# Altium project PS3604LF.PrjPcb
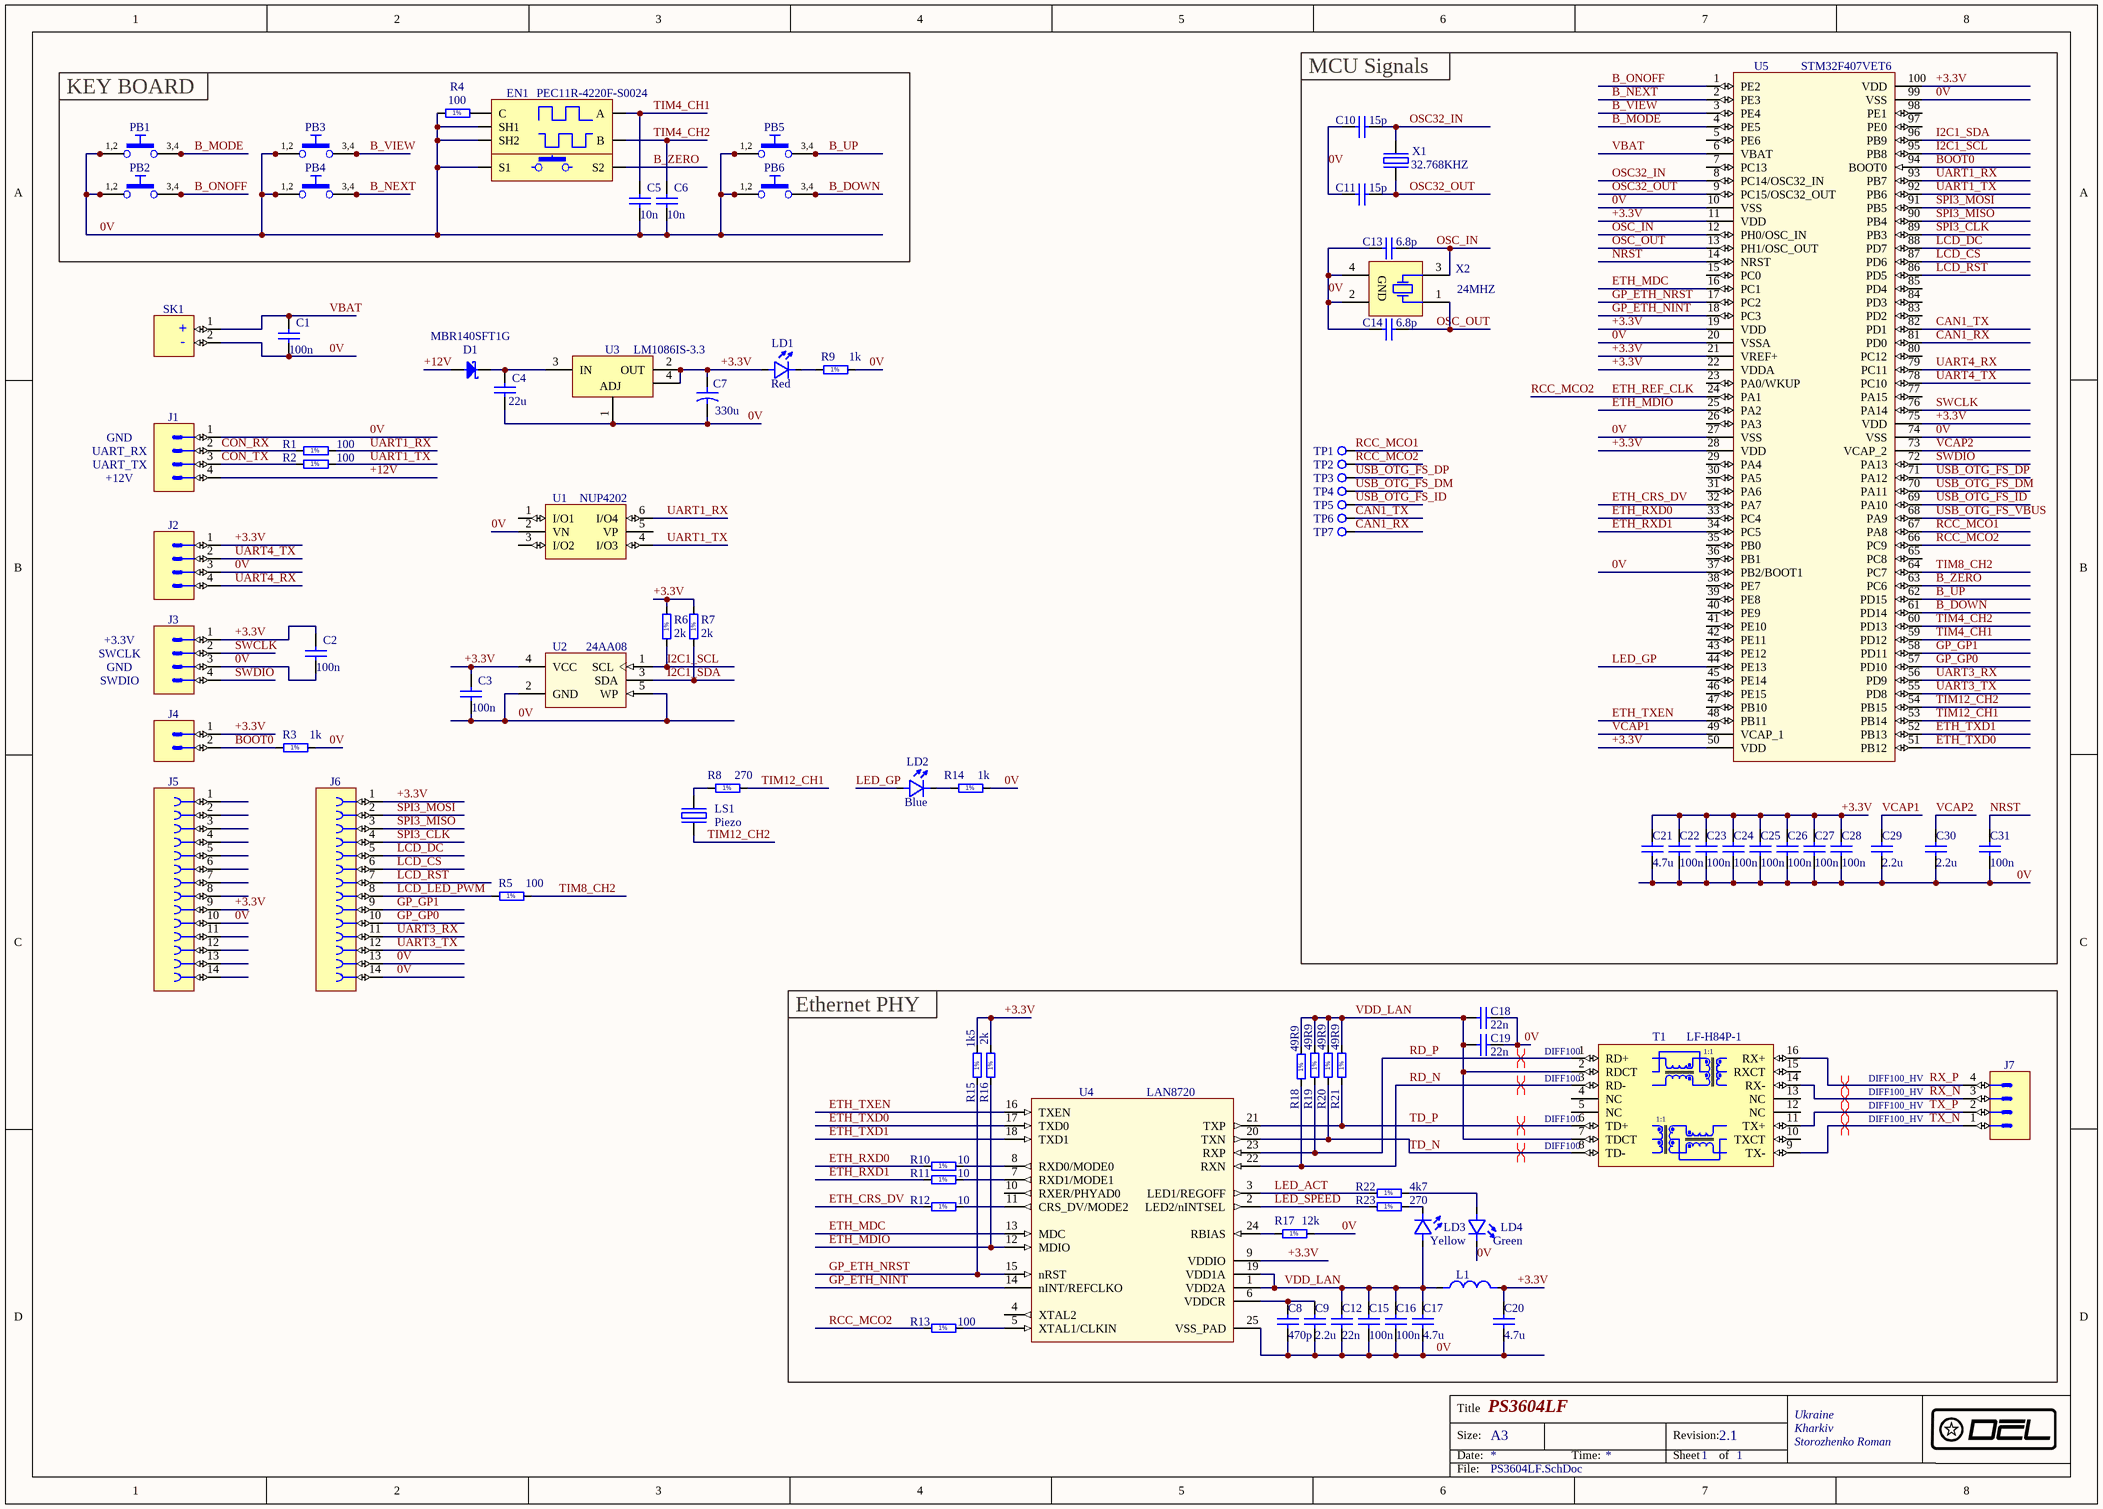
[diagram p0: PS3604LF.SchDoc]
1 sheet, 91 parts. Net scope: global (net labels, ports and power ports of the same name join across sheets).
Board file: PS3604LF.PcbDoc

## Sheet PS3604LF.SchDoc: PS3604LF
size A3; Author: Storozhenko Roman; CompanyName: D_EL; DrawnBy: Storozhenko Roman; Address1: Ukraine; Address2: Kharkiv; Revision: 2.1; SheetNumber: 1; SheetTotal: 1

### Parts
C1  100n  [CAPC1005X55N]
C2  100n  [CAPC1005X55N]
C3  100n  [CAPC1005X55N]
C4  22u  [CAPC3216X100N]
C5  10n  [CAPC1005X55N]
C6  10n  [CAPC1005X55N]
C7  330u  [CAPMP7343X310N]
C8  470p  [CAPC1005X55N]
C9  2.2u  [CAPC1005X55N]
C10  15p  [CAPC1005X55N]
C11  15p  [CAPC1005X55N]
C12  22n  [CAPC1005X55N]
C13  6.8p  [CAPC1005X55N]
C14  6.8p  [CAPC1005X55N]
C15  100n  [CAPC1005X55N]
C16  100n  [CAPC1005X55N]
C17  4.7u  [CAPC1608X87N]
C18  22n  [CAPC1005X55N]
C19  22n  [CAPC1005X55N]
C20  4.7u  [CAPC1608X87N]
C21  4.7u  [CAPC1608X87N]
C22  100n  [CAPC1005X55N]
C23  100n  [CAPC1005X55N]
C24  100n  [CAPC1005X55N]
C25  100n  [CAPC1005X55N]
C26  100n  [CAPC1005X55N]
C27  100n  [CAPC1005X55N]
C28  100n  [CAPC1005X55N]
C29  2.2u  [CAPC1005X55N]
C30  2.2u  [CAPC1005X55N]
C31  100n  [CAPC1005X55N]
D1  MBR140SFT1G  [SOD-123FL]
EN1  PEC11R-4220F-S0024  [EN_BOURNS_PEC11R-4x20F-Sxxxx]
J1  SPOX  [MOLEX_22-03-5045]  (value not drawn)
J2  Header 4  [3M_2304-6111-TG]  (value not drawn)
J3  Header 4  [3M_2304-6111-TG]  (value not drawn)
J4  Header 2  [3M_2302-6111-TG]  (value not drawn)
J5  Socket 14  [3M_955114-6102-AR]  (value not drawn)
J6  Socket 14  [3M_955114-6102-AR]  (value not drawn)
J7  SPOX  [MOLEX_22-03-5045]  (value not drawn)
L1  2.2uH  [INDC2520X100N]  (value not drawn)
LD1  Red  [LEDC1608X80N_RED]
LD2  Blue  [LEDC1608X80N_BLUE]
LD3  Yellow  [LEDC1608X80N_YELLOW]
LD4  Green  [LEDC1608X80N_GREEN]
LS1  Piezo  [HPS13C]
PB1  Push Button  [PB_E-SWITCH_TL1105HF100Q]  (value not drawn)
PB2  Push Button  [PB_E-SWITCH_TL1105HF100Q]  (value not drawn)
PB3  Push Button  [PB_E-SWITCH_TL1105HF100Q]  (value not drawn)
PB4  Push Button  [PB_E-SWITCH_TL1105HF100Q]  (value not drawn)
PB5  Push Button  [PB_E-SWITCH_TL1105HF100Q]  (value not drawn)
PB6  Push Button  [PB_E-SWITCH_TL1105HF100Q]  (value not drawn)
R1  100  [RESC1005X40N]
R2  100  [RESC1005X40N]
R3  1k  [RESC1005X40N]
R4  100  [RESC1005X40N]
R5  100  [RESC1005X40N]
R6  2k  [RESC1005X40N]
R7  2k  [RESC1005X40N]
R8  270  [RESC1005X40N]
R9  1k  [RESC1005X40N]
R10  10  [RESC1005X40N]
R11  10  [RESC1005X40N]
R12  10  [RESC1005X40N]
R13  100  [RESC1005X40N]
R14  1k  [RESC1005X40N]
R15  1k5  [RESC1005X40N]
R16  2k  [RESC1005X40N]
R17  12k  [RESC1005X40N]
R18  49R9  [RESC1005X40N]
R19  49R9  [RESC1005X40N]
R20  49R9  [RESC1005X40N]
R21  49R9  [RESC1005X40N]
R22  4k7  [RESC1005X40N]
R23  270  [RESC1005X40N]
SK1  BH500  [EEMB_BH500]  (value not drawn)
T1  LF-H84P-1  [XFMR_LF-H84P]
TP1  Test Point  [TP_SMD_800]  (value not drawn)
TP2  Test Point  [TP_SMD_800]  (value not drawn)
TP3  Test Point  [TP_SMD_800]  (value not drawn)
TP4  Test Point  [TP_SMD_800]  (value not drawn)
TP5  Test Point  [TP_SMD_800]  (value not drawn)
TP6  Test Point  [TP_SMD_800]  (value not drawn)
TP7  Test Point  [TP_SMD_800]  (value not drawn)
U1  NUP4202  [SOT65P220X110-6N]
U2  24AA08  [SOT95P280X145-5N]
U3  LM1086IS-3.3  [TO254P1435X464-4N-R1041X635]
U4  LAN8720  [QFN50P400X400X100-25N-S265]
U5  STM32F407VET6  [QFP50P1600X1600X160-100N]
X1  32.768KHZ  [OSCCC150X320X80-2N]
X2  24MHZ  [OSCCC160X200X65-4N]

### Blocks framed on the sheet
MCU Signals: C10 C11 C13 C14 C21-C31 TP1-TP7 U5 X1 X2
KEY BOARD: C5 C6 EN1 PB1-PB6 R4
Ethernet PHY: C8 C9 C12 C15-C20 J7 L1 LD3 LD4 R10-R13 R15-R23 T1 U4

### Nets
0V: C1.1 C2.1 C3.1 C4.1 C5.1 C6.1 C7.2 C8.1 C9.1 C10.1 C11.1 C12.2 C13.1 C14.1 C15.1 C16.1 C17.1 C18.2 C19.2 C20.1 C21.1 C22.1 C23.1 C24.1 C25.1 C26.1 C27.1 C28.1 C29.1 C30.1 C31.1 EN1.S1 EN1.SH1 EN1.SH2 J1.1 J2.3 J3.3 J5.10 J6.13 J6.14 LD4.1(C) PB1.1 PB1.2 PB2.1 PB2.2 PB3.1 PB3.2 PB4.1 PB4.2 PB5.1 PB5.2 PB6.1 PB6.2 R3.2 R4.1 R9.2 R14.2 R17.2 SK1.2 U1.2(VN) U2.2(GND) U2.5(WP) U3.1(ADJ) U4.25(VSS_PAD) U5.10(VSS) U5.20(VSSA) U5.27(VSS) U5.37(PB2/BOOT1) U5.74(VSS) U5.99(VSS) X2.2(GND) X2.4(GND)
+3.3V: C2.2 C3.2 C7.1 C20.2 C21.2 C22.2 C23.2 C24.2 C25.2 C26.2 C27.2 C28.2 J2.1 J3.1 J4.1 J5.9 J6.1 L1.2 LD1.2(A) R6.2 R7.2 R15.2 R16.2 U2.4(VCC) U3.2(OUT) U3.4(OUT) U4.9(VDDIO) U5.11(VDD) U5.19(VDD) U5.21(VREF+) U5.22(VDDA) U5.28(VDD) U5.50(VDD) U5.75(VDD) U5.100(VDD)
+12V: D1.2(A) J1.4
B_DOWN: PB6.3 PB6.4 U5.61(PD14)
B_MODE: PB1.3 PB1.4 U5.4(PE5)
B_NEXT: PB4.3 PB4.4 U5.2(PE3)
B_ONOFF: PB2.3 PB2.4 U5.1(PE2)
B_UP: PB5.3 PB5.4 U5.62(PD15)
B_VIEW: PB3.3 PB3.4 U5.3(PE4)
B_ZERO: EN1.S2 U5.63(PC6)
BOOT0: J4.2 R3.1 U5.94(BOOT0)
CAN1_RX: TP7.1 U5.81(PD0)
CAN1_TX: TP6.1 U5.82(PD1)
CON_RX: J1.2 R1.1
CON_TX: J1.3 R2.1
ETH_CRS_DV: R12.1 U5.32(PA7)
ETH_MDC: U4.13(MDC) U5.16(PC1)
ETH_MDIO: R16.1 U4.12(MDIO) U5.25(PA2)
ETH_REF_CLK: R13.1 TP2.1 U5.24(PA1) U5.66(PC9)  [also labelled RCC_MCO2]
ETH_RXD0: R10.1 U5.33(PC4)
ETH_RXD1: R11.1 U5.34(PC5)
ETH_TXD0: U4.17(TXD0) U5.51(PB12)
ETH_TXD1: U4.18(TXD1) U5.52(PB13)
ETH_TXEN: U4.16(TXEN) U5.48(PB11)
GP_ETH_NINT: U4.14(nINT/REFCLKO) U5.18(PC3)
GP_ETH_NRST: R15.1 U4.15(nRST) U5.17(PC2)
GP_GP0: J6.10 U5.57(PD10)
GP_GP1: J6.9 U5.58(PD11)
I2C1_SCL: R6.1 U2.1(SCL) U5.95(PB8)
I2C1_SDA: R7.1 U2.3(SDA) U5.96(PB9)
LCD_CS: J6.6 U5.87(PD6)
LCD_DC: J6.5 U5.88(PD7)
LCD_LED_PWM: J6.8 R5.1
LCD_RST: J6.7 U5.86(PD5)
LED_ACT: R22.1 U4.3(LED1/REGOFF)
LED_GP: LD2.2(A) U5.44(PE13)
LED_SPEED: R23.1 U4.2(LED2/nINTSEL)
NRST: C31.2 U5.14(NRST)
OSC32_IN: C10.2 U5.8(PC14/OSC32_IN) X1.2(OSC2)
OSC32_OUT: C11.2 U5.9(PC15/OSC32_OUT) X1.1(OSC1)
OSC_IN: C13.2 U5.12(PH0/OSC_IN) X2.3(X)
OSC_OUT: C14.2 U5.13(PH1/OSC_OUT) X2.1(X)
RCC_MCO1: TP1.1 U5.67(PA8)
RD_N: R18.1 T1.3(RD-) U4.22(RXN)
RD_P: R19.1 T1.1(RD+) U4.23(RXP)
RX_N: J7.3 T1.14(RX-)
RX_P: J7.4 T1.16(RX+)
SPI3_CLK: J6.4 U5.89(PB3)
SPI3_MISO: J6.3 U5.90(PB4)
SPI3_MOSI: J6.2 U5.91(PB5)
SWCLK: J3.2 U5.76(PA14)
SWDIO: J3.4 U5.72(PA13)
TD_N: R20.1 T1.8(TD-) U4.20(TXN)
TD_P: R21.1 T1.6(TD+) U4.21(TXP)
TIM4_CH1: C5.2 EN1.A U5.59(PD12)
TIM4_CH2: C6.2 EN1.B U5.60(PD13)
TIM8_CH2: R5.2 U5.64(PC7)
TIM12_CH1: R8.2 U5.53(PB14)
TIM12_CH2: LS1.1(OSC1) U5.54(PB15)
TX_N: J7.1 T1.9(TX-)
TX_P: J7.2 T1.11(TX+)
UART1_RX: R1.2 U1.6(I/O4) U5.93(PB7)
UART1_TX: R2.2 U1.4(I/O3) U5.92(PB6)
UART3_RX: J6.11 U5.56(PD9)
UART3_TX: J6.12 U5.55(PD8)
UART4_RX: J2.4 U5.79(PC11)
UART4_TX: J2.2 U5.78(PC10)
USB_OTG_FS_DM: TP4.1 U5.70(PA11)
USB_OTG_FS_DP: TP3.1 U5.71(PA12)
USB_OTG_FS_ID: TP5.1 U5.69(PA10)
USB_OTG_FS_VBUS: U5.68(PA9)
VBAT: C1.2 SK1.1 U5.6(VBAT)
VCAP1: C29.2 U5.49(VCAP_1)
VCAP2: C30.2 U5.73(VCAP_2)
VDD_LAN: C12.1 C15.2 C16.2 C17.2 C18.1 C19.1 L1.1 LD3.2(A) R18.2 R19.2 R20.2 R21.2 T1.2(RDCT) T1.7(TDCT) U4.1(VDD2A) U4.19(VDD1A)
NetC4_2: C4.2 D1.1(C) U3.3(IN)
NetC8_2: C8.2 C9.2 U4.6(VDDCR)
NetEN1_C: EN1.C R4.2
NetLD1_1: LD1.1(C) R9.1
NetLD2_1: LD2.1(C) R14.1
NetLD3_1: LD3.1(C) R23.2
NetLD4_2: LD4.2(A) R22.2
NetLS1_2: LS1.2(OSC2) R8.1
NetR10_2: R10.2 U4.8(RXD0/MODE0)
NetR11_2: R11.2 U4.7(RXD1/MODE1)
NetR12_2: R12.2 U4.11(CRS_DV/MODE2)
NetR13_2: R13.2 U4.5(XTAL1/CLKIN)
NetR17_1: R17.1 U4.24(RBIAS)

Not connected (* = marked no-connect by the designer): J5 1 2 3 4 5 6 7 8 11 12 13 14; T1 4(NC) 5(NC) 10(TXCT) 12(NC) 13(NC) 15(RXCT); U1 1(I/O1) 3(I/O2) 5(VP); U4 4(XTAL2) 10(RXER/PHYAD0); U5 5(PE6) 7(PC13) 15(PC0) 23(PA0/WKUP) 26(PA3) 29(PA4) 30(PA5) 31(PA6) 35(PB0) 36(PB1) 38(PE7) 39(PE8) 40(PE9) 41(PE10) 42(PE11) 43(PE12) 45(PE14) 46(PE15) 47(PB10) 65(PC8) 77(PA15) 80(PC12) 83(PD2) 84(PD3) 85(PD4) 97(PE0) 98(PE1)

### Layout directives
differential pair; net class DIFF100: RD_N, RD_P, TD_N, TD_P
differential pair; net class DIFF100_HV: RX_N, RX_P, TX_N, TX_P

### Notes on the sheet
- GND
- (near J1) UART_RX
- +12V
- (near J1) UART_TX
- +3.3V
- SWCLK
- SWDIO
- Title
- Size:
- Date:
- A3
- Time:
- Revision:
- Sheet
- of
- File:
- (in symbol EEMB_BH500) +; -
- (in symbol PB_E-SWITCH_TL1105HF100Q) 1,2; 3,4
- (in symbol R0402_1K5_1%_0.0625W_100PPM) 1%
- (in symbol R0402_1K_1%_0.0625W_100PPM) 1%
- (in symbol R0402_2K_1%_0.0625W_100PPM) 1%
- (in symbol R0402_4K7_1%_0.0625W_100PPM) 1%
- (in symbol R0402_10R_1%_0.0625W_200PPM) 1%
- (in symbol R0402_12K_1%_0.0625W_100PPM) 1%
- (in symbol R0402_49R9_1%_0.0625W_100PPM) 1%
- (in symbol R0402_100R_1%_0.0625W_100PPM) 1%
- (in symbol R0402_270R_1%_0.0625W_100PPM) 1%
- (in symbol XFMR_LF-H84P-1) 1:1

### Library data of the parts
C1-C3 C15 C16 C22-C28 C31 = CC0402_100NF_50V_10%_X7R: Non-polarised capacitor; Part Description: SMD Multilayer Chip Ceramic Capacitor; Manufacturer: GENERIC; Manufacturer1 Part Number: C0402B104K500NU; Voltage: 50V; TC: X7R; Tolerance: ±10%; Part Number: CC0402_100NF_50V_10%_X7R; Component Kind: Standard; Component Type: Standard; Pin Count: 2; Value: 100n; Status: Not Recommended; Manufacturer Part Number: CC0402_100NF_50V_10%_X7R; Case: 0402; Mounted: Yes; Socket: No; SMD: Yes; Manufacturer1 Example: HITANO; Manufacturer1 ComponentHeight: 0.55mm; Author: DEL; CreateDate: 13.11.2017; LatestRevisionDate: 13.11.2017
C4 = CC1206_22UF_16V_20%_X5R: Non-polarised capacitor; Part Description: SMD Multilayer Chip Ceramic Capacitor; Manufacturer: GENERIC; Manufacturer1 Part Number: CL31A226MOCLNNC; Voltage: 16V; TC: X5R; Tolerance: ±20%; Part Number: CC1206_22UF_16V_20%_X5R; Component Kind: Standard; Component Type: Standard; Pin Count: 2; Value: 22u; Status: Preferred; Manufacturer Part Number: CC1206_22UF_16V_20%_X5R; Case: 1206; Mounted: Yes; Socket: No; SMD: Yes; Manufacturer1 Example: Samsung; Manufacturer1 ComponentHeight: 1mm; Author: D_EL; CreateDate: 13.06.2017; LatestRevisionDate: 13.06.2017
C5 C6 = CC0402_10NF_50V_10%_X7R: Non-polarised capacitor; Part Description: SMD Multilayer Chip Ceramic Capacitor; Manufacturer: GENERIC; Manufacturer1 Part Number: C0402C103K5RACTU; Voltage: 50V; TC: X7R; Tolerance: ±10%; Part Number: CC0402_10NF_50V_10%_X7R; Component Kind: Standard; Component Type: Standard; Pin Count: 2; Value: 10n; Status: None; Manufacturer Part Number: CC0402_10NF_50V_10%_X7R; Case: 0402; Mounted: Yes; Socket: No; SMD: Yes; Manufacturer1 Example: KEMET; Manufacturer1 ComponentHeight: 0.55mm; Author: DEL; CreateDate: 19.12.2017; LatestRevisionDate: 19.12.2017
C7 = CTE7343-31_330UF_6.3V_20%_LESR0025_KEMET_T520: Polarised capacitor; Part Description: Low ESR 0R025 Tantalum Chip Capacitor; Manufacturer: KEMET; Manufacturer Part Number: T520D337M006ATE025; Voltage: 6.3V; Tolerance: ±20%; Part Number: CTE7343-31_330UF_6.3V_20%_LESR0025_KEMET_T520; Component Kind: Standard; Component Type: Standard; Pin Count: 2; Value: 330u; Status: None; Case: D; Mounted: Yes; Socket: No; SMD: Yes; ComponentHeight: 3.1mm; HelpURL: \\cern.ch\dfs\Applications\Altium\Datasheets\CTE-LESR_KEMET_T520.pdf; Author: CERN DEM JLC; CreateDate: 20.10.2010; LatestRevisionDate: 20.10.2010
C8 = CC0402_470PF_50V_10%_X7R: Non-polarised capacitor; Part Description: SMD Multilayer Chip Ceramic Capacitor; Manufacturer: GENERIC; Manufacturer1 Part Number: 223858715618; Voltage: 50V; TC: X7R; Tolerance: ±10%; Part Number: CC0402_470PF_50V_10%_X7R; Component Kind: Standard; Component Type: Standard; Pin Count: 2; Value: 470p; Status: Not Recommended; Manufacturer Part Number: CC0402_470PF_50V_10%_X7R; Case: 0402; Mounted: Yes; Socket: No; SMD: Yes; Manufacturer1 Example: PHYCOMP; Manufacturer1 ComponentHeight: 0.55mm; HelpURL: \\cern.ch\dfs\Applications\Altium\Datasheets\CC0402_NP0_PHYCOMP.pdf; Author: CERN DEM JLC; CreateDate: 03.12.2007; LatestRevisionDate: 03.12.2007
C9 C29 C30 = CC0402_2.2UF_6.3V_20%_X5R: Non-polarised capacitor; Part Description: SMD Multilayer Chip Ceramic Capacitor; Manufacturer: GENERIC; Voltage: 6.3V; TC: X5R; Tolerance: ±20%; Part Number: CC0402_2.2UF_6.3V_20%_X5R; Component Kind: Standard; Component Type: Standard; Pin Count: 2; Value: 2.2u; Status: Preferred; Manufacturer Part Number: CC0402_2.2UF_6.3V_20%_X5R; Case: 0402; Mounted: Yes; Socket: No; SMD: Yes; Manufacturer1 ComponentHeight: 0.55mm; HelpURL: \\cern.ch\dfs\Applications\Altium\Datasheets\CC0402_X5R_KEMET.pdf; Author: ELMAN; CreateDate: 19.05.2015; LatestRevisionDate: 19.05.2015
C10 C11 = CC0402_15PF_50V_5%_NP0: Non-polarised capacitor; Part Description: SMD Multilayer Chip Ceramic Capacitor; Manufacturer: GENERIC; Manufacturer1 Part Number: 223886915159; Voltage: 50V; TC: NP0; Tolerance: ±5%; Part Number: CC0402_15PF_50V_5%_NP0; Component Kind: Standard; Component Type: Standard; Pin Count: 2; Value: 15p; Status: Not Recommended; Manufacturer Part Number: CC0402_15PF_50V_5%_NP0; Case: 0402; Mounted: Yes; Socket: No; SMD: Yes; Manufacturer1 Example: PHYCOMP; Manufacturer1 ComponentHeight: 0.55mm; HelpURL: \\cern.ch\dfs\Applications\Altium\Datasheets\CC0402_NP0_PHYCOMP.pdf; Author: CERN DEM JLC; CreateDate: 03.12.2007; LatestRevisionDate: 03.12.2007
C12 C18 C19 = CC0402_22NF_16V_10%_X7R: Non-polarised capacitor; Part Description: SMD Multilayer Chip Ceramic Capacitor; Manufacturer: GENERIC; Manufacturer1 Part Number: 223878715641; Voltage: 16V; TC: X7R; Tolerance: ±10%; Part Number: CC0402_22NF_16V_10%_X7R; Component Kind: Standard; Component Type: Standard; Pin Count: 2; Value: 22n; Status: Not Recommended; Manufacturer Part Number: CC0402_22NF_16V_10%_X7R; Case: 0402; Mounted: Yes; Socket: No; SMD: Yes; Manufacturer1 Example: PHYCOMP; Manufacturer1 ComponentHeight: 0.55mm; HelpURL: \\cern.ch\dfs\Applications\Altium\Datasheets\CC0402_X7R_PHYCOMP.pdf; Author: CERN DEM JLC; CreateDate: 03.12.2007; LatestRevisionDate: 03.12.2007
C13 C14 = CC0402_6.8PF_50V_0.5PF_NP0: Non-polarised capacitor; Part Description: SMD Multilayer Chip Ceramic Capacitor; Manufacturer: GENERIC; Manufacturer1 Part Number: 223886915688; Voltage: 50V; TC: NP0; Tolerance: ±0.5pF; Part Number: CC0402_6.8PF_50V_0.5PF_NP0; Component Kind: Standard; Component Type: Standard; Pin Count: 2; Value: 6.8p; Status: Not Recommended; Manufacturer Part Number: CC0402_6.8PF_50V_0.5PF_NP0; Case: 0402; Mounted: Yes; Socket: No; SMD: Yes; Manufacturer1 Example: PHYCOMP; Manufacturer1 ComponentHeight: 0.55mm; HelpURL: \\cern.ch\dfs\Applications\Altium\Datasheets\CC0402_NP0_PHYCOMP.pdf; Author: CERN DEM JLC; CreateDate: 03.12.2007; LatestRevisionDate: 03.12.2007
C17 C20 C21 = CC0603_4.7UF_10V_10%_X5R: Non-polarised capacitor; Part Description: SMD Multilayer Chip Ceramic Capacitor; Manufacturer: GENERIC; Manufacturer1 Part Number: C1608X5R1A475K080AC; Voltage: 10V; TC: X5R; Tolerance: ±10%; Part Number: CC0603_4.7UF_10V_10%_X5R; Component Kind: Standard; Component Type: Standard; Pin Count: 2; Value: 4.7u; Status: Preferred; Manufacturer Part Number: CC0603_4.7uF_10V_10%_X5R; Case: 0603; Mounted: Yes; Socket: No; SMD: Yes; Manufacturer1 Example: TDK; Manufacturer1 ComponentHeight: 0.95mm; Author: ELMAN; CreateDate: 13.11.2016; LatestRevisionDate: 13.11.2016
D1 = MBR140SFT1G: Schottky Diode; Part Description: Schottky Power Rectifier; Manufacturer: ON SEMICONDUCTOR; Voltage: 40V; Power: 1A; Part Number: MBR140SFT1G; Component Kind: Standard; Component Type: Standard; Device: MBR140SFT1G; PackageDescription: Small Outline Diode Flat Lead (SOD-123FL), Body; 2.70mm L X 1.65mm W X 1.0mm H; Manufacturer Part Number: MBR140SFT1G; Pin Count: 2; Case: SOD-123FL; Mounted: Yes; Socket: No; SMD: Yes; ComponentHeight: 1.0mm; HelpURL: \\cern.ch\dfs\Applications\Altium\Datasheets\MBR140SFT1G.pdf; Author: CERN DEM JLC; CreateDate: 06.04.2009; LatestRevisionDate: 06.04.2009
EN1 = EN_BOUNCE_PEC11R-4220F-S0024: Encoder incremental with push momentary switch; Part Description: 12 mm Incremental Encoder,  24 pulses, Push Momentary Switch; Manufacturer: BOURNS; Part Number: EN_BOUNCE_PEC11R-4220F-S0024; Component Kind: Standard; Component Type: Standard; Pin Count: 5; PackageDescription: Standard Shaft Length 20.0 mm; Family: Incremental Encoder; Mounted: Yes; Socket: No; SMD: No; Status: None; Manufacturer Part Number: PEC11R-4220F-S0024; ComponentHeight: 26.5mm; Author: DEL; CreateDate: 09.11.2017; LatestRevisionDate: 09.11.2017
J1 J7 = MOLEX_22-03-5045: Connector 4 Male; Part Description: 2.50mm Pitch SPOX Wire-to-Board Header, Vertical, Shrouded, 4 Circuits, Tin (Sn) Plating; Manufacturer: MOLEX; Part Number: MOLEX_22-03-5045; Component Kind: Standard; Component Type: Standard; Pin Count: 4; Family: SPOX; Mounted: Yes; Socket: No; SMD: No; Status: None; Manufacturer Part Number: 22-27-2041; ComponentHeight: 5.9mm; Author: DEL; CreateDate: 21.10.2017; LatestRevisionDate: 21.10.2017
J2 J3 = 3M_2304-6111-TG: Connector 4 Male; Part Description: 4 Contacts - Vertival Contacts Straight Strip Header Pitch 2.54; Manufacturer: 3M; Part Number: 3M_2304-6111-TG; Component Kind: Standard; Component Type: Standard; Pin Count: 4; Family: Header 4; Mounted: Yes; Socket: No; SMD: No; Status: None; Manufacturer Part Number: 3M_2304-6111-TG; ComponentHeight: 8.4mm; Author: DEL; CreateDate: 2018-09-13; LatestRevisionDate: 2018-09-13
J4 = 3M_2302-6111-TG: Connector 2 Male; Part Description: 2 Contacts - Horizontal Contacts Straight Strip Header Pitch 2.54; Manufacturer: 3M; Part Number: 3M_2302-6111-TG; Component Kind: Standard; Component Type: Standard; Pin Count: 2; Family: Header 2; Mounted: Yes; Socket: No; SMD: No; Status: None; Manufacturer Part Number: 3M_2302-6111-TG; ComponentHeight: 8.4mm; Author: DEL; CreateDate: 2018-09-13; LatestRevisionDate: 2018-09-13
J5 J6 = 3M_955114-6102-AR: Connector 14 Female; Part Description: 14 Contacts - 2mm x 2 mm Straight, Boardmount Socket, 950 Serie; Manufacturer: 3M; Part Number: 3M_955114-6102-AR; Component Kind: Standard; Component Type: Standard; Pin Count: 14; Family: Socket 14; Mounted: Yes; Socket: No; SMD: No; Status: None; Manufacturer Part Number: 955114-6102-AR; ComponentHeight: 4.3mm; Author: DEL; CreateDate: 02.11.2017; LatestRevisionDate: 02.11.2017
L1 = IND1008_2.2UH_20%_TDK_MLP2520S2R2MT0S1: Inductor; Part Description: SMT Inductors; Manufacturer: TDK; Power: 1.2A; Resistance: 0.117R; Tolerance: ±20%; Part Number: IND1008_2.2UH_20%_TDK_MLP2520S2R2MT0S1; Component Kind: Standard; Component Type: Standard; Pin Count: 2; Value: 2.2uH; Status: None; Manufacturer Part Number: MLP2520S2R2MT0S1; Case: 1008; Mounted: Yes; Socket: No; SMD: Yes; ComponentHeight: 1mm; HelpURL: C:\eftek\library\doc\DS_SPICE\capacitors\TDK\inductor_commercial_power_mlp2520_en.pdf; Author: ELMAN; CreateDate: 02.02.2016; LatestRevisionDate: 02.02.2016
LD1 = LED_OF-SMD1608R: LED 1C 2A; Part Description: Surface Mount Red LED (0603 Case); Manufacturer: OPTOFLASH; Part Number: LED_OF-SMD1608R; Component Kind: Standard; Component Type: Standard; Color: Red; PackageDescription: Chip Red LED, 2-Leads, Body 1.6x0.8mm, IPC Medium Density; Manufacturer Part Number: OF-SMD1608R; Pin Count: 2; Case: 0603; Mounted: Yes; Socket: No; SMD: Yes; ComponentHeight: 0.8mm; Author: ELMAN; CreateDate: 27.08.2015; LatestRevisionDate: 27.08.2015
LD2 = LED_OF-SMD1608B: LED 1C 2A; Part Description: Surface Mount Red LED (0603 Case); Manufacturer: OPTOFLASH; Part Number: LED_OF-SMD1608B; Component Kind: Standard; Component Type: Standard; Color: Blue; PackageDescription: Chip Blue LED, 2-Leads, Body 1.6x0.8mm, IPC Medium Density; Manufacturer Part Number: OF-SMD1608B; Pin Count: 2; Case: 0603; Mounted: Yes; Socket: No; SMD: Yes; ComponentHeight: 0.8mm; Author: DEL; CreateDate: 11.12.2017; LatestRevisionDate: 11.12.2017
LD3 = LED_OF-SMD1608Y: LED 1C 2A; Part Description: Surface Mount Red LED (0603 Case); Manufacturer: OPTOFLASH; Manufacturer Part Number: OF-SMD1608R; Part Number: LED_OF-SMD1608Y; Component Kind: Standard; Component Type: Standard; Color: Yellow; PackageDescription: Chip Yellow LED, 2-Leads, Body 1.6x0.8mm, IPC Medium Density; Pin Count: 2; Case: 0603; Mounted: Yes; Socket: No; SMD: Yes; ComponentHeight: 0.8mm; Author: DEL; CreateDate: 11.12.2017; LatestRevisionDate: 11.12.2017
LD4 = LED_OF-SMD1608G: LED 1C 2A; Part Description: Surface Mount Green LED (0603 Case); Manufacturer: OPTOFLASH; Part Number: LED_OF-SMD1608G; Component Kind: Standard; Component Type: Standard; Color: Green; PackageDescription: Chip Green LED, 2-Leads, Body 1.6x0.8mm, IPC Medium Density; Manufacturer Part Number: OF-SMD1608G; Pin Count: 2; Case: 0603; Mounted: Yes; Socket: No; SMD: Yes; ComponentHeight: 0.8mm; Author: ELMAN; CreateDate: 27.08.2015; LatestRevisionDate: 27.08.2015
LS1 = HPS13C: Piezo Sounder; Part Description: Piezo sound generator; Manufacturer: JL WORLD; Output: >= 80 dB; Part Number: HPS13C; Component Kind: Standard; Component Type: Standard; Pin Count: 2; PackageDescription: 12.8 x 12.8 x 2.5 mm; Family: Piezo; Mounted: Yes; Socket: No; SMD: Yes; Manufacturer Part Number: HPS13C; ComponentHeight: 1.2mm; Author: DEL; CreateDate: 10.11.2017; LatestRevisionDate: 10.11.2017
PB1-PB6 = PB_E-SWITCH_TL1105HF100Q: Push-Button Switch SPDT; Part Description: 12VDC 50mA SPST Tactile  Push-Button Switch; Manufacturer Part Number: TL3305AF260QG; Part Number: PB_E-SWITCH_TL1105HF100Q; Component Kind: Standard; Component Type: Standard; Pin Count: 4; PackageDescription: 6mm x 6mm Body, Surface Mount Tactile Switches; Family: Push Button; Mounted: Yes; Socket: No; SMD: Yes; Status: None; Manufacturer: E-SWITCH; ComponentHeight: 3.8mm; Author: DEL; CreateDate: 06.11.2017; LatestRevisionDate: 07.11.2017
R1 R2 R4 R5 R13 = R0402_100R_1%_0.0625W_100PPM: Resistor - 1%; Part Description: General Purpose Thick Film Chip Resistor; Manufacturer: GENERIC; Manufacturer1 Part Number: 232270671001; TC: ±100ppm/°C; Part Number: R0402_100R_1%_0.0625W_100PPM; Component Kind: Standard; Component Type: Standard; Pin Count: 2; Value: 100; Status: Not recommended; Power: 0.0625W; Tolerance: ±1%; Manufacturer Part Number: R0402_100R_1%_0.0625W_100PPM; Case: 0402; Mounted: Yes; Socket: No; SMD: Yes; Manufacturer1 Example: PHYCOMP; Manufacturer1 ComponentHeight: 0.4mm; HelpURL: \\cern.ch\dfs\Applications\Altium\Datasheets\R0402_Phycomp_RC0402.pdf; Author: CERN DEM JLC; CreateDate: 03.12.2007; LatestRevisionDate: 13.03.2008
R3 R9 R14 = R0402_1K_1%_0.0625W_100PPM: Resistor - 1%; Part Description: General Purpose Thick Film Chip Resistor; Manufacturer: GENERIC; Manufacturer1 Part Number: 232270671002; TC: ±100ppm/°C; Part Number: R0402_1K_1%_0.0625W_100PPM; Component Kind: Standard; Component Type: Standard; Pin Count: 2; Value: 1k; Status: Not recommended; Power: 0.0625W; Tolerance: ±1%; Manufacturer Part Number: R0402_1K_1%_0.0625W_100PPM; Case: 0402; Mounted: Yes; Socket: No; SMD: Yes; Manufacturer1 Example: PHYCOMP; Manufacturer1 ComponentHeight: 0.4mm; HelpURL: \\cern.ch\dfs\Applications\Altium\Datasheets\R0402_Phycomp_RC0402.pdf; Author: CERN DEM JLC; CreateDate: 03.12.2007; LatestRevisionDate: 13.03.2008
R6 R7 R16 = R0402_2K_1%_0.0625W_100PPM: Resistor - 1%; Part Description: General Purpose Thick Film Chip Resistor; Manufacturer: GENERIC; Manufacturer1 Part Number: 232270672002; TC: ±100ppm/°C; Part Number: R0402_2K_1%_0.0625W_100PPM; Component Kind: Standard; Component Type: Standard; Pin Count: 2; Value: 2k; Status: Not recommended; Power: 0.0625W; Tolerance: ±1%; Manufacturer Part Number: R0402_2K_1%_0.0625W_100PPM; Case: 0402; Mounted: Yes; Socket: No; SMD: Yes; Manufacturer1 Example: PHYCOMP; Manufacturer1 ComponentHeight: 0.4mm; HelpURL: \\cern.ch\dfs\Applications\Altium\Datasheets\R0402_Phycomp_RC0402.pdf; Author: CERN DEM JLC; CreateDate: 03.12.2007; LatestRevisionDate: 13.03.2008
R8 R23 = R0402_270R_1%_0.0625W_100PPM: Resistor - 1%; Part Description: General Purpose Thick Film Chip Resistor; Manufacturer: GENERIC; Manufacturer1 Part Number: 232270672701; TC: ±100ppm/°C; Part Number: R0402_270R_1%_0.0625W_100PPM; Component Kind: Standard; Component Type: Standard; Pin Count: 2; Value: 270; Status: Not recommended; Power: 0.0625W; Tolerance: ±1%; Manufacturer Part Number: R0402_270R_1%_0.0625W_100PPM; Case: 0402; Mounted: Yes; Socket: No; SMD: Yes; Manufacturer1 Example: PHYCOMP; Manufacturer1 ComponentHeight: 0.4mm; HelpURL: \\cern.ch\dfs\Applications\Altium\Datasheets\R0402_Phycomp_RC0402.pdf; Author: CERN DEM JLC; CreateDate: 2007-12-03; LatestRevisionDate: 2008-03-13
R10-R12 = R0402_10R_1%_0.0625W_200PPM: Resistor - 1%; Part Description: General Purpose Thick Film Chip Resistor; Manufacturer: GENERIC; Manufacturer1 Part Number: 232270671009; TC: ±200ppm/°C; Part Number: R0402_10R_1%_0.0625W_200PPM; Component Kind: Standard; Component Type: Standard; Pin Count: 2; Value: 10; Status: Not recommended; Power: 0.0625W; Tolerance: ±1%; Manufacturer Part Number: R0402_10R_1%_0.0625W_200PPM; Case: 0402; Mounted: Yes; Socket: No; SMD: Yes; Manufacturer1 Example: PHYCOMP; Manufacturer1 ComponentHeight: 0.4mm; HelpURL: \\cern.ch\dfs\Applications\Altium\Datasheets\R0402_Phycomp_RC0402.pdf; Author: CERN DEM JLC; CreateDate: 24.06.2009; LatestRevisionDate: 13.03.2008
R15 = R0402_1K5_1%_0.0625W_100PPM: Resistor - 1%; Part Description: General Purpose Thick Film Chip Resistor; Manufacturer: GENERIC; Manufacturer1 Part Number: 232270671502; TC: ±100ppm/°C; Part Number: R0402_1K5_1%_0.0625W_100PPM; Component Kind: Standard; Component Type: Standard; Pin Count: 2; Value: 1k5; Status: Not recommended; Power: 0.0625W; Tolerance: ±1%; Manufacturer Part Number: R0402_1K5_1%_0.0625W_100PPM; Case: 0402; Mounted: Yes; Socket: No; SMD: Yes; Manufacturer1 Example: PHYCOMP; Manufacturer1 ComponentHeight: 0.4mm; HelpURL: \\cern.ch\dfs\Applications\Altium\Datasheets\R0402_Phycomp_RC0402.pdf; Author: CERN DEM JLC; CreateDate: 03.12.2007; LatestRevisionDate: 13.03.2008
R17 = R0402_12K_1%_0.0625W_100PPM: Resistor - 1%; Part Description: General Purpose Thick Film Chip Resistor; Manufacturer: GENERIC; Manufacturer1 Part Number: 232270671203; TC: ±100ppm/°C; Part Number: R0402_12K_1%_0.0625W_100PPM; Component Kind: Standard; Component Type: Standard; Pin Count: 2; Value: 12k; Status: Not recommended; Power: 0.0625W; Tolerance: ±1%; Manufacturer Part Number: R0402_12K_1%_0.0625W_100PPM; Case: 0402; Mounted: Yes; Socket: No; SMD: Yes; Manufacturer1 Example: PHYCOMP; Manufacturer1 ComponentHeight: 0.4mm; HelpURL: \\cern.ch\dfs\Applications\Altium\Datasheets\R0402_Phycomp_RC0402.pdf; Author: CERN DEM JLC; CreateDate: 03.12.2007; LatestRevisionDate: 13.03.2008
R18-R21 = R0402_49R9_1%_0.0625W_100PPM: Resistor - 1%; Part Description: General Purpose Thick Film Chip Resistor; Manufacturer: GENERIC; Manufacturer1 Part Number: 232270674702; TC: ±100ppm/°C; Part Number: R0402_49R9_1%_0.0625W_100PPM; Component Kind: Standard; Component Type: Standard; Pin Count: 2; Value: 49R9; Status: Not recommended; Power: 0.0625W; Tolerance: ±1%; Manufacturer Part Number: R0402_49R9_1%_0.0625W_100PPM; Case: 0402; Mounted: Yes; Socket: No; SMD: Yes; Manufacturer1 Example: PHYCOMP; Manufacturer1 ComponentHeight: 0.4mm; HelpURL: \\cern.ch\dfs\Applications\Altium\Datasheets\R0402_Phycomp_RC0402.pdf; Author: ELMAN; CreateDate: 20.05.2015; LatestRevisionDate: 20.05.2015
R22 = R0402_4K7_1%_0.0625W_100PPM: Resistor - 1%; Part Description: General Purpose Thick Film Chip Resistor; Manufacturer: GENERIC; Manufacturer1 Part Number: 232270674702; TC: ±100ppm/°C; Part Number: R0402_4K7_1%_0.0625W_100PPM; Component Kind: Standard; Component Type: Standard; Pin Count: 2; Value: 4k7; Status: Not recommended; Power: 0.0625W; Tolerance: ±1%; Manufacturer Part Number: R0402_4K7_1%_0.0625W_100PPM; Case: 0402; Mounted: Yes; Socket: No; SMD: Yes; Manufacturer1 Example: PHYCOMP; Manufacturer1 ComponentHeight: 0.4mm; HelpURL: \\cern.ch\dfs\Applications\Altium\Datasheets\R0402_Phycomp_RC0402.pdf; Author: CERN DEM JLC; CreateDate: 2007-12-03; LatestRevisionDate: 2008-03-13
SK1 = EEMB_BH500: Battery holder; Part Description: Battery holder for CR and LIR series1216 to 1220,1225; Manufacturer: EEMB; Part Number: EEMB_BH500; Component Kind: Standard; Component Type: Standard; Pin Count: 2; Mounted: Yes; Socket: No; SMD: Yes; Status: None; Device: BH500; Manufacturer Part Number: BH500; ComponentHeight: 4mm; Author: DEL; CreateDate: 22.10.2017; LatestRevisionDate: 22.10.2017
T1 = XFMR_LF-H84P-1: Signal Transformers 10/100 Base-T XFMR 1 Port LAN; Part Number: PE-68678; Part Description: 10/100BASE-Tx PC Card LAN Magnetics Module; Manufacturer: LANKom; Component Kind: Standard; Component Type: Standard; Pin Count: 16; Value: LF-H84P-1; Status: None; Manufacturer Part Number: LF-H84P-1; Mounted: Yes; Socket: No; SMD: No; ComponentHeight: 2mm; Author: DEL; CreateDate: 10.10.2017; LatestRevisionDate: 10.10.2017
TP1-TP7 = TP_SMD_0.8MM: Part Description: 0.8mm round SMD Pad; Mounted: No; Part Number: TP_SMD_0.8MM; Component Kind: Standard (No BOM); Component Type: Standard (No BOM); Pin Count: 1; Family: Test Point; Socket: No; SMD: No; Status: None; ComponentHeight: 0mm; Author: DEL; CreateDate: 14.11.2017; LatestRevisionDate: 14.11.2017; PackageDescription: 0.8mm round SMD Pad
U1 = NUP4202W1: ESD Protection Diode, Low  Clamping Voltage; Manufacturer: ON SEMICONDUCTOR; Manufacturer Part Number: NUP4202W1T2G; Part Number: NUP4202W1; Component Kind: Standard; Component Type: Standard; Device: NUP4202; PackageDescription: SOT363, 0.65mm pitch; 6 pin, 1.25mm W X 2mm L, IPC Medium Density; Part Description: ESD Protection Diode, Low  Clamping Voltage; Pin Count: 6; Case: SOT363; Mounted: Yes; Socket: No; SMD: Yes; ComponentHeight: 1.1mm; Author: DEL; CreateDate: 10.11.2017; LatestRevisionDate: 10.11.2017
U2 = 24AA08T-I/OT: I2C™ Serial EEPROM SOT23-5 Package; Part Description: 8K Serial EEPROM; Manufacturer: MICROCHIP; Part Number: 24AA08T-I/OT; Component Kind: Standard; Component Type: Standard; Device: 24AA08; PackageDescription: SOT, 0.95mm pitch; 5 pin, 1.60mm W X 2.90mm L X 1.45mm H body, IPC Medium Density; Manufacturer Part Number: 24AA08T-I/OT; Pin Count: 5; Case: SOT23-5; Mounted: Yes; Socket: No; SMD: Yes; ComponentHeight: 1.45mm; Author: DEL; CreateDate: 09.11.2017; LatestRevisionDate: 09.11.2017
U3 = LM1086IS-3.3: 3-Terminal Regulator 1=Adj 2=OUT 3=IN 4=OUT; Part Description: 3.3V 1.5A Low Dropout Positive Regulators; Manufacturer: TEXAS INSTRUMENTS; Part Number: LM1086IS-3.3; Component Kind: Standard; Component Type: Standard; Device: LM1086IS-3.3; PackageDescription: TO-263, TO, 2.54mm pitch; 3 pin,14.35mm L X 8.64mm W X 4.64mm H body IPC Medium Density; Manufacturer Part Number: LM1086IS-3.3; Pin Count: 4; Case: TO-263; Mounted: Yes; Socket: No; SMD: Yes; ComponentHeight: 4.64mm; Author: D_EL; CreateDate: 20.10.2017; LatestRevisionDate: 20.10.2017
U4 = LAN8720A-CP-TR: Part Description: Small Footprint RMII 10/100 Ethernet Transceiver with HP Auto-MDIX Support; Manufacturer: Microchip; Part Number: LAN8720A-CP-TR; Component Kind: Standard; Component Type: Standard; Device: LAN8720; PackageDescription: QFN,0.50mm pitch,square;6 pin X 6 pin,4.0mm X 4.0mm X 1.00mm H body (w/thermal tab 2.65 X 2.65mm); Manufacturer Part Number: LAN8720A-CP-TR; Pin Count: 25; Case: QFN24; Mounted: Yes; Socket: No; SMD: Yes; ComponentHeight: 1mm; Author: DEL; CreateDate: 10.08.2017; LatestRevisionDate: 11.10.2017
U5 = STM32F407VET6: ARM Cortex-M4 32b MCU+FPU, 210DMIPS, up to 1MB Flash/192+4KB RAM, USB OTG HS/FS, Ethernet, 17 TIMs, 3 ADCs, 15 comm. interfaces & camera; Manufacturer: ST Microelectronics; Part Number: STM32F407VET6; Component Kind: Standard; Component Type: Standard; Device: STM32F407VET6; PackageDescription: QFP, 0.50mm Pitch, Square; 100 Pin,14.00mm L X 14.00mm W X 1.60mm H Body; Part Description: ARM Cortex-M4 32b MCU+FPU, 210DMIPS, up to 1MB Flash/192+4KB RAM, USB OTG HS/FS, Ethernet, 17 TIMs, 3 ADCs, 15 comm. interfaces & camera; Manufacturer Part Number: STM32F407VET6; Pin Count: 100; Case: LQFP100; Mounted: Yes; Socket: No; SMD: Yes; ComponentHeight: 1.6mm; Author: DEL; CreateDate: 11.10.2017; LatestRevisionDate: 11.10.2017
X1 = 32.768KHz_KX–327NHT: Quartz Crystal; Part Description: Quartz Crystal ±20ppm; Manufacturer: GEYER; Part Number: 32.768KHz_KX–327NHT; Component Kind: Standard; Component Type: Standard; PackageDescription: 2 pin, 3.20mm L X 1.50mm W X 0.80mm H; Value: 32.768KHZ; Manufacturer Part Number: KX–327NHT; Pin Count: 2; Mounted: Yes; Socket: No; SMD: Yes; ComponentHeight: 0.8mm; Author: D_EL; CreateDate: 15.06.2017; LatestRevisionDate: 15.06.2017
X2 = 24MHZ_XRCGB24M000F3M00R0: Crystal 4 pins 1=XTAL 2=GND3=XTAL 4=GND; Part Description: ± 30ppm at (25±3°C), -30°C to +85°C, 6pF, Ceramic SMD Crystal, Type HCR2016; Manufacturer: MURATA; Manufacturer Part Number: 7XRCGB24M000F3M00R0; Part Number: 24MHZ_XRCGB24M000F3M00R0; Component Kind: Standard; Component Type: Standard; PackageDescription: Oscillator, corner concave; 4 pin, 2.00mm L X 1.60mm W X 0.65mm H, IPC Medium Density; Value: 24MHZ; Pin Count: 4; Mounted: Yes; Socket: No; SMD: Yes; ComponentHeight: 0.7mm; Author: D_EL; CreateDate: 17.06.2017; LatestRevisionDate: 17.06.2017